# Altium schematic sheet PROC051D_VPP_Supply.SchDoc: VPP_Supply
size 431 x 279 mm; Date: Not shown in title block; ApprovedBy: Not shown in title block; CheckedBy: Not shown in title block; Author: Not shown in title block; CompanyName: Not shown in title block; Engineer: Not shown in title block; Organization: Not shown in title block; Address1: Not shown in title block; Address2: Not shown in title block; Address3: Not shown in title block; Address4: Not shown in title block; DocumentNumber: 9; Revision: Use project parameter SCH_Rev; SheetNumber: 9; SheetTotal: 16; PageSetup: Record=PageOptions|CenterHorizontal=True|CenterVertical=True|PrintScale=1.00|XCorrection=1.00|YCorrection=1.00|PrintKind=0|BorderSize=5000000|LeftOffset=0|BottomOffset=0|Orientation=2|PaperLength=1000|PaperWidth=1000|Scale=100|PaperSource=15|PrintQuality=600|MediaType=1|DitherType=10|PaperKind=Letter|PrintScaleMode=1; CurrentTime: Not shown in title block; CurrentDate: Not shown in title block; Time: Not shown in title block; DocumentFullPathAndName: Not shown in title block; DocumentName: Not shown in title block; ModifiedDate: Not shown in title block; ImagePath: Not shown in title block
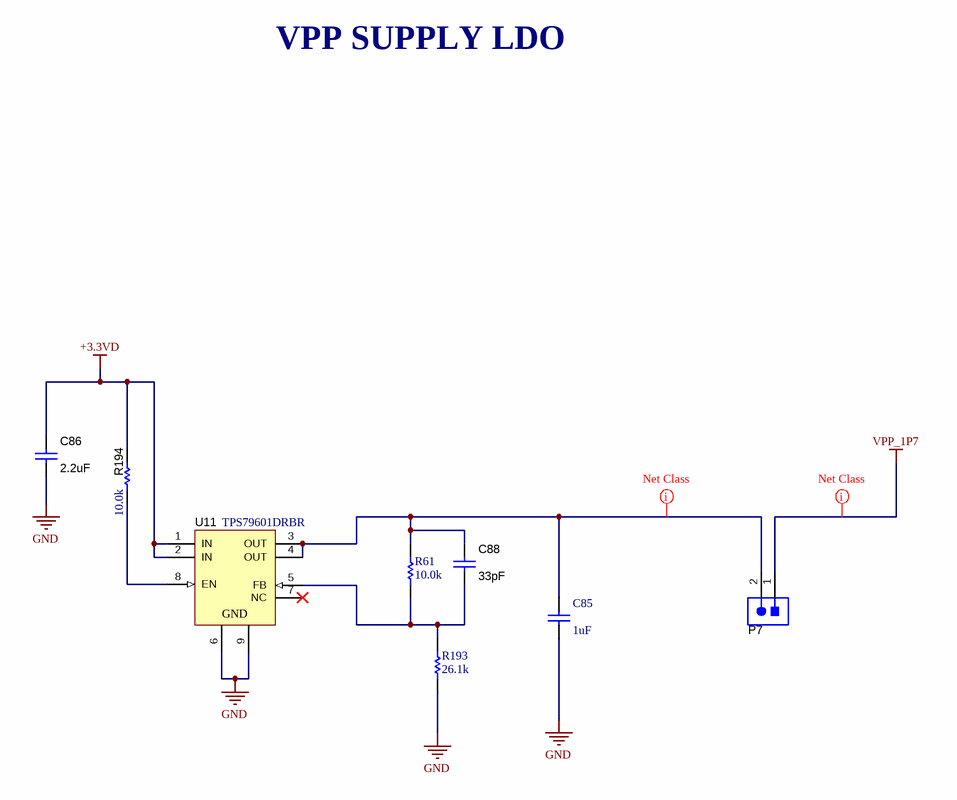
[diagram p0: PROC051D_VPP_Supply.SchDoc]

## Parts
C85  ValueDisplayed: 1uF  [0402]  (hidden comment: GRM155R70J105MA12D)
C86  ValueDisplayed: 2.2uF  [0402_065L]  (hidden comment: C1005X7S1A225K050BC)
C88  ValueDisplayed: 33pF  [0402L]  (hidden comment: C0402C330J5GAC)
P7  TSW-102-07-G-S  [TSW-102-07-G-S]  (value not drawn)
R61  ValueDisplayed: 10.0k  [0402]  (hidden comment: ERJ-2RKF1002X)
R193  ValueDisplayed: 26.1k  [0402]  (hidden comment: CRCW040226K1FKED)
R194  ValueDisplayed: 10.0k  [0402L]  (hidden comment: CRCW040210K0FKED)
U11  TPS79601DRBR  [DRB0008B]

## Nets
+3.3VD: C86.2 R194.1 U11.1(IN) U11.2(IN)
GND: C85.2 C86.1 R193.1 U11.6(GND) U11.9(GND)
VPP_1P7: P7.1
NetC85_1: C85.1 C88.1 P7.2 R61.2 U11.3(OUT) U11.4(OUT)
NetC88_2: C88.2 R61.1 R193.2 U11.5(FB)
NetR194_2: R194.2 U11.8(EN)

Not connected (* = marked no-connect by the designer): U11 7(NC)*

## Layout directives
net class PWR: NetC85_1, VPP_1P7

## Notes on the sheet
- VPP SUPPLY LDO
- Drawn By:
- SVN Rev:
- Number:
- TID #:
- Orderable:
- Rev:
- Sheet Title:
- File:
- Project Title:
- Designed for:
- Assembly Variant:
- Mod. Date:
- Sheet:
- Size:
- of
- B
- http://www.ti.com
- Texas Instruments and/or its licensors do not warrant the accuracy or completeness of this specification or any information contained therein. Texas Instruments and/or its licensors do not warrant that this design will meet the specifications, will be suitable for your application or fit for any particular purpose, or will operate in an implementation. Texas Instruments and/or its licensors do not warrant that the design is production worthy. You should completely validate and test your design implementation to confirm the system functionality for your application.
- Engineer:
- Contact:
- © Texas Instruments

## Library data of the parts
C85 = CMP-0006624-2: CAP, CERM, 1 uF, 6.3 V, +/- 20%, X7R, 0402; Manufacturer: MuRata; TaMin_C: -55°C; Polarized: N; SizeAreaWB_mm2: 3; Value1: Unknown; U/M: EA; Value: 1uF; TaMax_C: 125°C; SizeZ_mm: 0.6; SizeX_mm: 1; SizeY_mm: 0.5; Value2: 6.3V; Cap_F: 1µF; AEC Category: Q200; Supplier Part Number 2: 81-GRM155R70J105MA2D; Publisher: Texas Instruments; Supplier 2: Mouser; TempCo: X7R; Published: 2008-06-19; RoHS: Y; MountType: SMT; Supplier 1: Digi-Key; PackageReference: 0402; Tolerance_%: 20%; Cap_Case: 0402; SizeArea_mm2: 0.5; CompType: Capacitor; LatestRevisionDate: 2017-03-09; PartNumber: GRM155R70J105MA12D; AEC Qualified: N; VDC_V: 6.3V; ComponentLink1Description: Datasheet link; AEC Grade: N/A; Supplier Part Number 1: 490-9665-1-ND; Technology: Ceramic; ComponentLink1URL: http://psearch.en.murata.com/capacitor/product/GRM155R70J105MA12%23.pdf
C86 = CMP-0006302-2: CAP, CERM, 2.2 uF, 10 V, +/- 10%, X7S, 0402; Manufacturer: TDK; TaMin_C: -55°C; ESR_ohm: 5.925m; Polarized: N; SizeAreaWB_mm2: 3; Value1: 0.005925 ohm; U/M: EA; Value: 2.2uF; TaMax_C: 125°C; SizeZ_mm: 0.65; SizeX_mm: 1; SizeY_mm: 0.5; Cap_Case: 0402_065; Value2: 10V; CompType: Capacitor; Cap_F: 2.2µF; IRMS_A: 2.05591A; AEC Category: Q200; Supplier Part Number 2: 810-C1005X7S1A225K; Publisher: Texas Instruments; Supplier 2: Mouser; TempCo: X7S; Published: 2008-06-19; RoHS: Y; MountType: SMT; Supplier 1: Digi-Key; PackageReference: 0402; Tolerance_%: 10%; SizeArea_mm2: 0.5; LatestRevisionDate: 2017-03-09; PartNumber: C1005X7S1A225K050BC; AEC Qualified: N; VDC_V: 10V; ComponentLink1Description: Datasheet link; AEC Grade: N/A; Supplier Part Number 1: 445-9097-1-ND; Technology: Ceramic; ComponentLink1URL: https://product.tdk.com/en/search/capacitor/ceramic/mlcc/info?part_no=C1005X7S1A225K050BC
C88 = CMP-0006242-2: CAP, CERM, 33 pF, 50 V, +/- 5%, C0G/NP0, 0402; Manufacturer: Kemet; TaMin_C: -55°C; Polarized: N; SizeAreaWB_mm2: 3; Value1: Unknown; U/M: EA; Value: 33pF; TaMax_C: 125°C; SizeZ_mm: 0.6; SizeX_mm: 1; SizeY_mm: 0.5; Cap_Case: 0402; Value2: 50V; AEC Category: Q200; Supplier Part Number 2: 3019196; Publisher: Texas Instruments; Supplier 2: Farnell; TempCo: C0G/NP0; Published: 2008-06-19; RoHS: Y; MountType: SMT; Supplier 1: Digi-Key; PackageReference: 0402; Tolerance_%: 5%; SizeArea_mm2: 0.5; CompType: Capacitor; LatestRevisionDate: 2017-03-09; PartNumber: C0402C330J5GAC; AEC Qualified: ?; Cap_F: 33pF; VDC_V: 50V; ComponentLink1Description: Datasheet link; Supplier Part Number 1: 399-1017-1-ND; Technology: Ceramic; ComponentLink1URL: http://www.kemet.com/kemet/web/homepage/kechome.nsf/vapubfiles/F3102_Y5V.pdf/$file/F3102_Y5V.pdf
P7 = CMP-0075405-2: Header, 100mil, 2x1, Gold, TH; Manufacturer: Samtec; Pitch_mm: 2.54; Cert_VDE: N; Gender: Male; Cert_CSA: Y; Voltage_V: 550V; Green_REACh: Passed; Current_A: 6.3A; Green_Lifecycle: Active; Row_Count: 1; ComponentLink1Description: Datasheet URL; RoHS: Y; Supplier 1: Digi-Key; Cert_UL: Y; Orientation: Vertical; Green_EU RoHS: Passed; PackageReference: 2x1 Header; Color: Black; PartNumber: TSW-102-07-G-S; PinCount: 2; ContactFinish: Gold; Cert_CULUS: N; Shrouded: N; ClassName: Header; ComponentLink1URL: http://samtec.com/ftppub/pdf/TSW_TH.PDF; CompType: Header; MountType: TH; Supplier Part Number 1: SAM1029-02-ND; Green_EU RoHS-2: Passed
R61 = CMP-0026658-1: RES, 10.0 k, 1%, 0.1 W, 0402; Manufacturer: Panasonic; Power_W: 100mW; TempCo: 100 ppm/C; Value_Code: 10k0; U/M: EA; Value: 10.0k; EIA_Code: E96; Res_ohm: 10k; SizeX_mm: 1; SizeY_mm: 0.5; SizeZ_mm: 0.6; Value2: 0.1W; VDC_V: 50V; AEC Category: Q200; ComponentLink1URL: http://industrial.panasonic.com/www-data/pdf/AOA0000/AOA0000CE2.pdf; Supplier Part Number 2: 90W2949; Publisher: Texas Instruments; Supplier 2: Newark; Supplier Part Number 3: 667-ERJ-2RKF1002X; Supplier 3: Mouser; Published: 2008-06-26; RoHS: Y; Value1: 1%; MountType: SMT; Supplier 1: Digi-Key; PackageReference: 0402; Tolerance_%: 1%; SizeArea_mm2: 0.5; CompType: Resistor; LatestRevisionDate: 2017-03-09; PartNumber: ERJ-2RKF1002X; AEC Qualified: ?; ComponentLink1Description: Datasheet link; Supplier Part Number 1: P10.0KLCT-ND; Technology: Thick Film
R193 = CMP-0026207-2: RES, 26.1 k, 1%, 0.063 W, AEC-Q200 Grade 0, 0402; Manufacturer: Vishay-Dale; Power_W: 63mW; TempCo: 100 ppm/C; Value_Code: 26k1; Value: 26.1k; EIA_Code: E96; SizeX_mm: 1; SizeY_mm: 0.5; SizeZ_mm: 0.6; Value2: 0.063W; AEC Qualified: Y; VDC_V: 50V; AEC Category: Q200; AEC Grade: 0; ComponentLink1URL: http://www.vishay.com/docs/20035/dcrcwe3.pdf; Supplier Part Number 2: 52K6896; Supplier 2: Newark; Supplier Part Number 3: 71-CRCW0402-26.1K-E3; Supplier 3: Mouser; RoHS: E; Value1: 1%; MountType: SMT; Supplier 1: Digi-Key; PackageReference: 0402; Tolerance_%: 1%; Res_ohm: 26.1k; SizeArea_mm2: 0.5; CompType: Resistor; PartNumber: CRCW040226K1FKED; ComponentLink1Description: Datasheet link; Supplier Part Number 1: 541-26.1KLCT-ND; Technology: Thick Film
R194 = CMP-0025958-3: RES, 10.0 k, 1%, 0.063 W, AEC-Q200 Grade 0, 0402; Manufacturer: Vishay-Dale; Power_W: 63mW; TempCo: 100 ppm/C; Value_Code: 10k0; Value: 10.0k; EIA_Code: E96; Res_ohm: 10k; SizeX_mm: 1; SizeY_mm: 0.5; SizeZ_mm: 0.6; Value2: 0.063W; AEC Qualified: Y; VDC_V: 50V; AEC Category: Q200; AEC Grade: 0; Supplier Part Number 2: 52K6595; Supplier 2: Newark; Supplier Part Number 3: 71-CRCW0402-10K-E3; Supplier 3: Mouser; RoHS: E; Value1: 1%; MountType: SMT; Supplier 1: Digi-Key; PackageReference: 0402; Tolerance_%: 1%; SizeArea_mm2: 0.5; CompType: Resistor; PartNumber: CRCW040210K0FKED; ComponentLink1Description: Datasheet link; Supplier Part Number 1: 541-10.0KLCT-ND; Technology: Thick Film; ComponentLink1URL: http://www.vishay.com/docs/20035/dcrcwe3.pdf
U11 = CMP-0036402-3: Single Output High PSRR LDO, 1 A, Adjustable 1.2 to 5.5 V Output, 2.7 to 5.5 V Input, 8-pin SON (DRB), -40 to 125 degC, Green (RoHS & no Sb/Br); Manufacturer: Texas Instruments; Vin(Min)(V): 2.7; Vout Adj(Max)(V): 5.5; Vout Adj(Min)(V): 1.2; Accuracy(%): 2; SubFamily: Single Channel LDO; Iq(Typ)(mA): 0.26; Vdo(Typ)(mV): 250; Iout(Max)(A): 1; AEC Category: Q200; AEC Qualified: N; CompType: IC; SizeArea_mm2: 9.0; SizeAreaWB_mm2: 16.0; SizeX_mm: 3.0; SizeZ_mm: 1.0; ComponentLink1URL: http://www.ti.com/; Vin(Max)(V): 5.5; PackageDescription: VSON-8; ComponentLink2URL: http://www.ti.com/general/docs/lit/getliterature.tsp?genericPartNumber=TPS79601&fileType=pdf; ComponentLink3Description: Package Specification; Eco-Plan: Green (RoHS & no Sb/Br); ComponentLink2Description: Datasheet; ComponentLink3URL: http://www.ti.com/litv/pdf/mpds118h; PackageReference: DRB0008B; DatasheetVersion: SLVS351N; PartNumber: TPS79601DRBR; PackageVersion: 4203482-2/K; ComponentLink1Description: Manufacturer URL; MountType: SMT; RoHS: Y; SizeY_mm: 3.0